# Altium schematic sheet SRAM_BANK.SchDoc
size 127 x 304 mm; DocumentNumber: 2; SheetNumber: 2; SheetTotal: 13
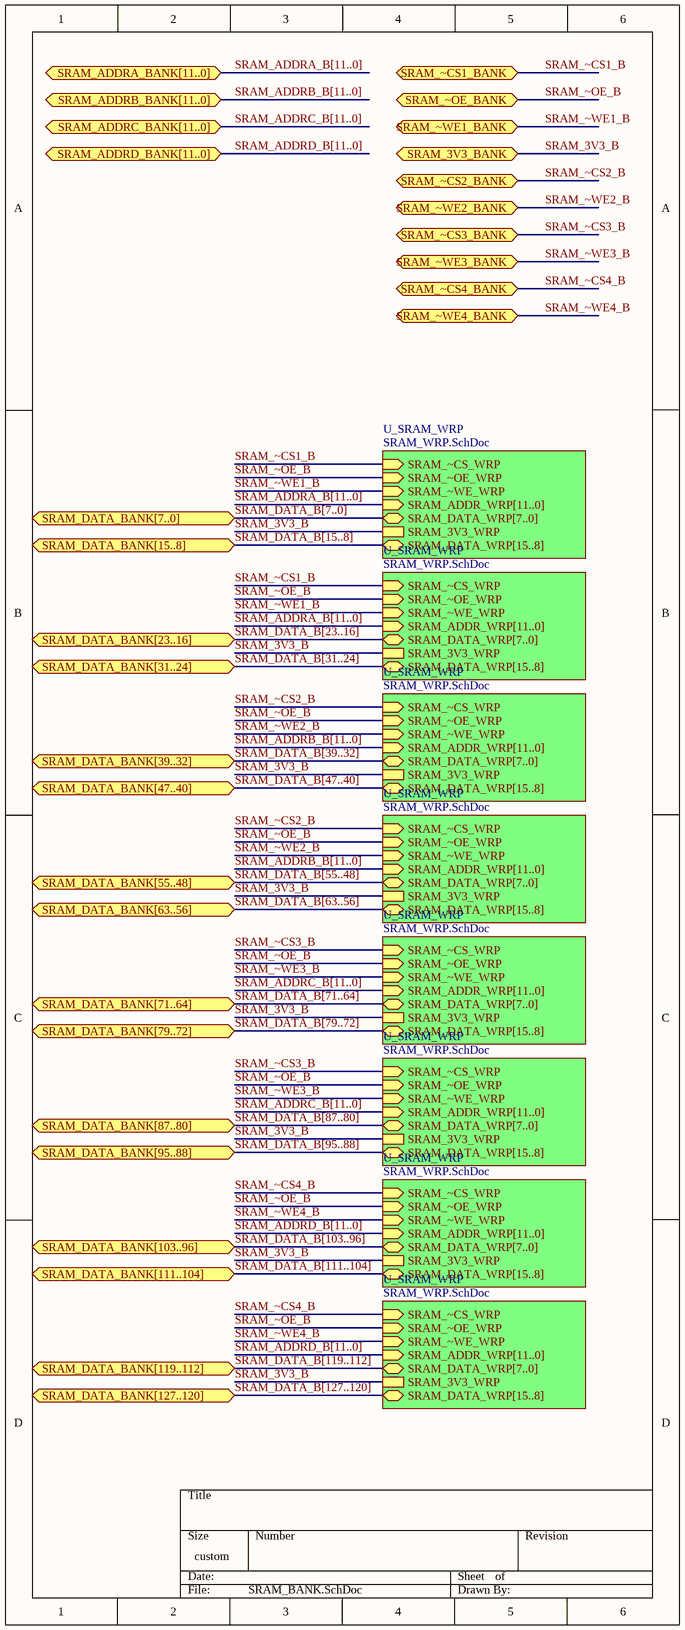
[diagram p0: SRAM_BANK.SchDoc]

## Sub-sheets
U_SRAM_WRP = SRAM_WRP.SchDoc: SRAM_~CS_WRP, SRAM_~OE_WRP, SRAM_~WE_WRP, SRAM_ADDR_WRP[11..0], SRAM_DATA_WRP[7..0], SRAM_3V3_WRP, SRAM_DATA_WRP[15..8]
U_SRAM_WRP = SRAM_WRP.SchDoc: SRAM_~CS_WRP, SRAM_~OE_WRP, SRAM_~WE_WRP, SRAM_ADDR_WRP[11..0], SRAM_DATA_WRP[7..0], SRAM_3V3_WRP, SRAM_DATA_WRP[15..8]
U_SRAM_WRP = SRAM_WRP.SchDoc: SRAM_~CS_WRP, SRAM_~OE_WRP, SRAM_~WE_WRP, SRAM_ADDR_WRP[11..0], SRAM_DATA_WRP[7..0], SRAM_3V3_WRP, SRAM_DATA_WRP[15..8]
U_SRAM_WRP = SRAM_WRP.SchDoc: SRAM_~CS_WRP, SRAM_~OE_WRP, SRAM_~WE_WRP, SRAM_ADDR_WRP[11..0], SRAM_DATA_WRP[7..0], SRAM_3V3_WRP, SRAM_DATA_WRP[15..8]
U_SRAM_WRP = SRAM_WRP.SchDoc: SRAM_~CS_WRP, SRAM_~OE_WRP, SRAM_~WE_WRP, SRAM_ADDR_WRP[11..0], SRAM_DATA_WRP[7..0], SRAM_3V3_WRP, SRAM_DATA_WRP[15..8]
U_SRAM_WRP = SRAM_WRP.SchDoc: SRAM_~CS_WRP, SRAM_~OE_WRP, SRAM_~WE_WRP, SRAM_ADDR_WRP[11..0], SRAM_DATA_WRP[7..0], SRAM_3V3_WRP, SRAM_DATA_WRP[15..8]
U_SRAM_WRP = SRAM_WRP.SchDoc: SRAM_~CS_WRP, SRAM_~OE_WRP, SRAM_~WE_WRP, SRAM_ADDR_WRP[11..0], SRAM_DATA_WRP[7..0], SRAM_3V3_WRP, SRAM_DATA_WRP[15..8]
U_SRAM_WRP = SRAM_WRP.SchDoc: SRAM_~CS_WRP, SRAM_~OE_WRP, SRAM_~WE_WRP, SRAM_ADDR_WRP[11..0], SRAM_DATA_WRP[7..0], SRAM_3V3_WRP, SRAM_DATA_WRP[15..8]

## Ports
SRAM_3V3_BANK, SRAM_ADDRA_BANK[11..0], SRAM_ADDRB_BANK[11..0], SRAM_ADDRC_BANK[11..0], SRAM_ADDRD_BANK[11..0], SRAM_DATA_BANK[7..0], SRAM_DATA_BANK[15..8], SRAM_DATA_BANK[23..16], SRAM_DATA_BANK[31..24], SRAM_DATA_BANK[39..32], SRAM_DATA_BANK[47..40], SRAM_DATA_BANK[55..48], SRAM_DATA_BANK[63..56], SRAM_DATA_BANK[71..64], SRAM_DATA_BANK[79..72], SRAM_DATA_BANK[87..80], SRAM_DATA_BANK[95..88], SRAM_DATA_BANK[103..96], SRAM_DATA_BANK[111..104], SRAM_DATA_BANK[119..112], SRAM_DATA_BANK[127..120], SRAM_~CS1_BANK, SRAM_~CS2_BANK, SRAM_~CS3_BANK, SRAM_~CS4_BANK, SRAM_~OE_BANK, SRAM_~WE1_BANK, SRAM_~WE2_BANK, SRAM_~WE3_BANK, SRAM_~WE4_BANK

## Nets
SRAM_3V3_B: port SRAM_3V3_BANK, sheet U_SRAM_WRP/SRAM_3V3_WRP, sheet U_SRAM_WRP/SRAM_3V3_WRP, sheet U_SRAM_WRP/SRAM_3V3_WRP, sheet U_SRAM_WRP/SRAM_3V3_WRP, sheet U_SRAM_WRP/SRAM_3V3_WRP, sheet U_SRAM_WRP/SRAM_3V3_WRP, sheet U_SRAM_WRP/SRAM_3V3_WRP, sheet U_SRAM_WRP/SRAM_3V3_WRP
SRAM_~CS1_B: port SRAM_~CS1_BANK, sheet U_SRAM_WRP/SRAM_~CS_WRP, sheet U_SRAM_WRP/SRAM_~CS_WRP
SRAM_~CS2_B: port SRAM_~CS2_BANK, sheet U_SRAM_WRP/SRAM_~CS_WRP, sheet U_SRAM_WRP/SRAM_~CS_WRP
SRAM_~CS3_B: port SRAM_~CS3_BANK, sheet U_SRAM_WRP/SRAM_~CS_WRP, sheet U_SRAM_WRP/SRAM_~CS_WRP
SRAM_~CS4_B: port SRAM_~CS4_BANK, sheet U_SRAM_WRP/SRAM_~CS_WRP, sheet U_SRAM_WRP/SRAM_~CS_WRP
SRAM_~OE_B: port SRAM_~OE_BANK, sheet U_SRAM_WRP/SRAM_~OE_WRP, sheet U_SRAM_WRP/SRAM_~OE_WRP, sheet U_SRAM_WRP/SRAM_~OE_WRP, sheet U_SRAM_WRP/SRAM_~OE_WRP, sheet U_SRAM_WRP/SRAM_~OE_WRP, sheet U_SRAM_WRP/SRAM_~OE_WRP, sheet U_SRAM_WRP/SRAM_~OE_WRP, sheet U_SRAM_WRP/SRAM_~OE_WRP
SRAM_~WE1_B: port SRAM_~WE1_BANK, sheet U_SRAM_WRP/SRAM_~WE_WRP, sheet U_SRAM_WRP/SRAM_~WE_WRP
SRAM_~WE2_B: port SRAM_~WE2_BANK, sheet U_SRAM_WRP/SRAM_~WE_WRP, sheet U_SRAM_WRP/SRAM_~WE_WRP
SRAM_~WE3_B: port SRAM_~WE3_BANK, sheet U_SRAM_WRP/SRAM_~WE_WRP, sheet U_SRAM_WRP/SRAM_~WE_WRP
SRAM_~WE4_B: port SRAM_~WE4_BANK, sheet U_SRAM_WRP/SRAM_~WE_WRP, sheet U_SRAM_WRP/SRAM_~WE_WRP

## Buses and harness runs
bus SRAM_ADDRA_B[11..0] = port SRAM_ADDRA_BANK[11..0]
bus SRAM_ADDRA_B[11..0] = sheet U_SRAM_WRP/SRAM_ADDR_WRP[11..0]
bus SRAM_ADDRB_B[11..0] = port SRAM_ADDRB_BANK[11..0]
bus SRAM_ADDRB_B[11..0] = sheet U_SRAM_WRP/SRAM_ADDR_WRP[11..0]
bus SRAM_ADDRC_B[11..0] = port SRAM_ADDRC_BANK[11..0]
bus SRAM_ADDRC_B[11..0] = sheet U_SRAM_WRP/SRAM_ADDR_WRP[11..0]
bus SRAM_ADDRD_B[11..0] = port SRAM_ADDRD_BANK[11..0]
bus SRAM_ADDRD_B[11..0] = sheet U_SRAM_WRP/SRAM_ADDR_WRP[11..0]
bus SRAM_DATA_B[7..0] = port SRAM_DATA_BANK[7..0] = sheet U_SRAM_WRP/SRAM_DATA_WRP[7..0]
bus SRAM_DATA_B[15..8] = port SRAM_DATA_BANK[15..8] = sheet U_SRAM_WRP/SRAM_DATA_WRP[15..8]
bus SRAM_DATA_B[23..16] = port SRAM_DATA_BANK[23..16] = sheet U_SRAM_WRP/SRAM_DATA_WRP[7..0]
bus SRAM_DATA_B[31..24] = port SRAM_DATA_BANK[31..24] = sheet U_SRAM_WRP/SRAM_DATA_WRP[15..8]
bus SRAM_DATA_B[39..32] = port SRAM_DATA_BANK[39..32] = sheet U_SRAM_WRP/SRAM_DATA_WRP[7..0]
bus SRAM_DATA_B[47..40] = port SRAM_DATA_BANK[47..40] = sheet U_SRAM_WRP/SRAM_DATA_WRP[15..8]
bus SRAM_DATA_B[55..48] = port SRAM_DATA_BANK[55..48] = sheet U_SRAM_WRP/SRAM_DATA_WRP[7..0]
bus SRAM_DATA_B[63..56] = port SRAM_DATA_BANK[63..56] = sheet U_SRAM_WRP/SRAM_DATA_WRP[15..8]
bus SRAM_DATA_B[71..64] = port SRAM_DATA_BANK[71..64] = sheet U_SRAM_WRP/SRAM_DATA_WRP[7..0]
bus SRAM_DATA_B[79..72] = port SRAM_DATA_BANK[79..72] = sheet U_SRAM_WRP/SRAM_DATA_WRP[15..8]
bus SRAM_DATA_B[87..80] = port SRAM_DATA_BANK[87..80] = sheet U_SRAM_WRP/SRAM_DATA_WRP[7..0]
bus SRAM_DATA_B[95..88] = port SRAM_DATA_BANK[95..88] = sheet U_SRAM_WRP/SRAM_DATA_WRP[15..8]
bus SRAM_DATA_B[103..96] = port SRAM_DATA_BANK[103..96] = sheet U_SRAM_WRP/SRAM_DATA_WRP[7..0]
bus SRAM_DATA_B[111..104] = port SRAM_DATA_BANK[111..104] = sheet U_SRAM_WRP/SRAM_DATA_WRP[15..8]
bus SRAM_DATA_B[119..112] = port SRAM_DATA_BANK[119..112] = sheet U_SRAM_WRP/SRAM_DATA_WRP[7..0]
bus SRAM_DATA_B[127..120] = port SRAM_DATA_BANK[127..120] = sheet U_SRAM_WRP/SRAM_DATA_WRP[15..8]